# Altium schematic sheet Sheet1.SchDoc
size A4
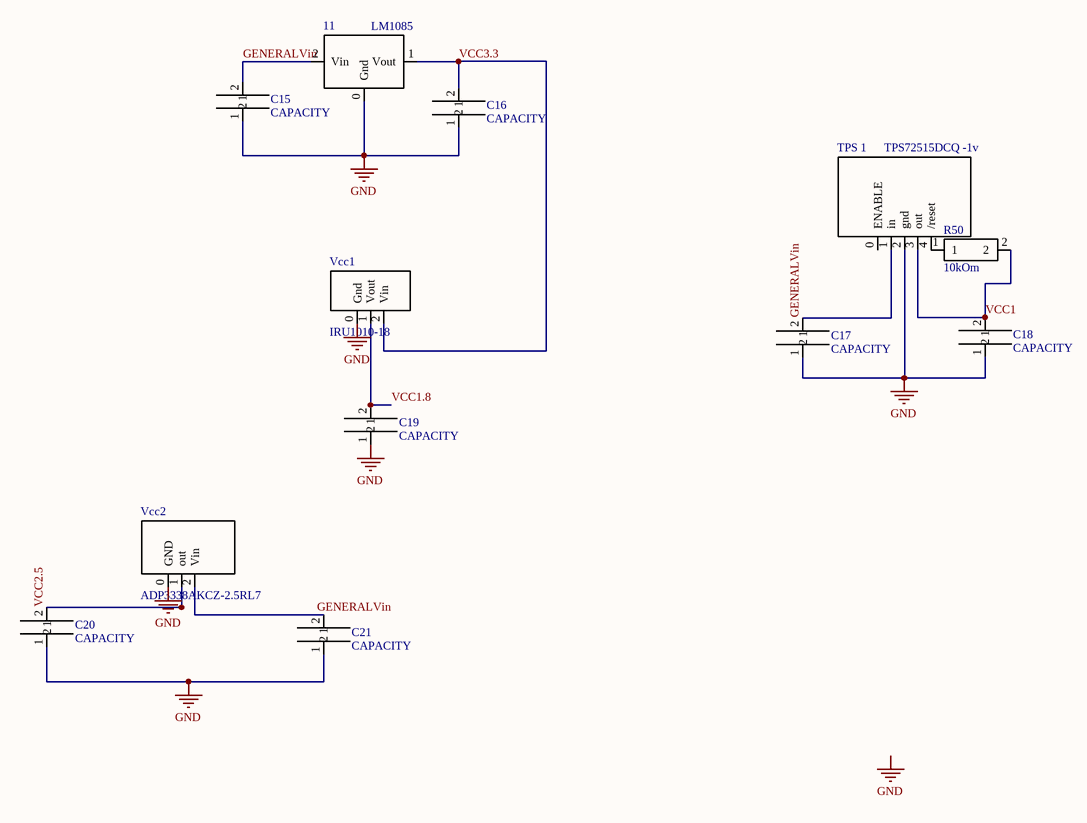
[diagram p0: Sheet1.SchDoc]

## Parts
11  LM1085  [LM1085]
C15  CAPACITY  [R0805]
C16  CAPACITY  [R0805]
C17  CAPACITY  [R0805]
C18  CAPACITY  [R0805]
C19  CAPACITY  [R0805]
C20  CAPACITY  [R0805]
C21  CAPACITY  [R0805]
R50  10kOm  [R0805]
TPS_1  TPS72515DCQ -1v  [SOT223-5]
Vcc1  IRU1010-18  [IRU1010-18]
Vcc2  ADP3338AKCZ-2.5RL7  [sot223]

## Nets
GND: 11.0(Gnd) C15.1 C16.1 C17.1 C18.1 C19.1 C20.1 C21.1 TPS_1.2(gnd) Vcc1.0(Gnd) Vcc2.0(GND)
GENERALVin: 11.2(Vin) C15.2 C17.2 C21.2 TPS_1.1(in) Vcc2.2(Vin)
VCC1: C18.2 R50.2 TPS_1.3(out)
VCC1.8: C19.2 Vcc1.1(Vout)
VCC2.5: C20.2 Vcc2.1(out)
VCC3.3: 11.1(Vout) C16.2 Vcc1.2(Vin)
NetR50_1: R50.1 TPS_1.4(/reset)

Not connected (* = marked no-connect by the designer): TPS_1 0(ENABLE)

## Notes on the sheet
- Labels drawn without touching a wire or pin: GND

## Library data of the parts
R50 = R0805